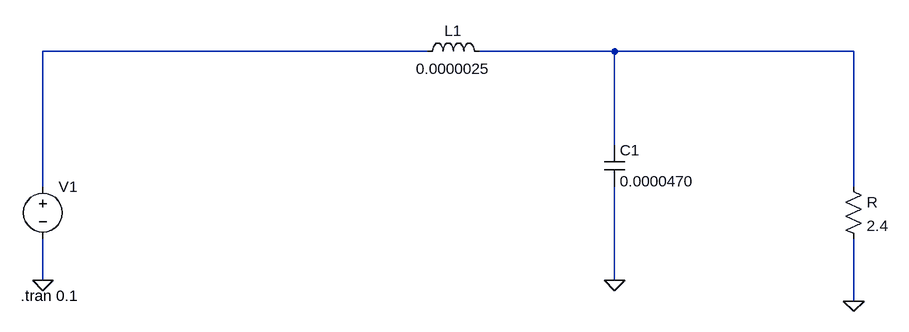
[diagram p0: schematic dc_dc_converter_filter.asc]
dc_dc_converter_filter.asc, the LTspice schematic file:
Version 4
SHEET 1 1340 680
WIRE 624 -192 32 -192
WIRE 912 -192 704 -192
WIRE 1280 -192 912 -192
WIRE 912 -48 912 -192
WIRE 32 16 32 -192
WIRE 1280 16 1280 -192
WIRE 32 160 32 96
WIRE 912 160 912 16
WIRE 1280 192 1280 96
FLAG 32 160 0
FLAG 1280 192 0
FLAG 912 160 0
SYMBOL voltage 32 0 R0
WINDOW 3 24 96 Invisible 2
WINDOW 123 0 0 Left 0
WINDOW 39 0 0 Left 0
SYMATTR InstName V1
SYMATTR Value PULSE(24 24.037 0 0.000001 0.000001 0.000001 0.000004)
SYMBOL res 1264 0 R0
SYMATTR InstName R
SYMATTR Value 2.4
SYMBOL ind 608 -176 R270
WINDOW 0 32 56 VTop 2
WINDOW 3 5 56 VBottom 2
SYMATTR InstName L1
SYMATTR Value 0.0000025
SYMBOL cap 896 -48 R0
SYMATTR InstName C1
SYMATTR Value 0.0000470
TEXT -2 184 Left 2 !.tran 0.1

The netlist it stands for:
* dc_dc_converter_filter.asc
V1 N001 0 PULSE(24 24.037 0 0.000001 0.000001 0.000001 0.000004)
R N002 0 2.4
L1 N001 N002 0.0000025
C1 N002 0 0.0000470
.tran 0.1
.backanno
.end